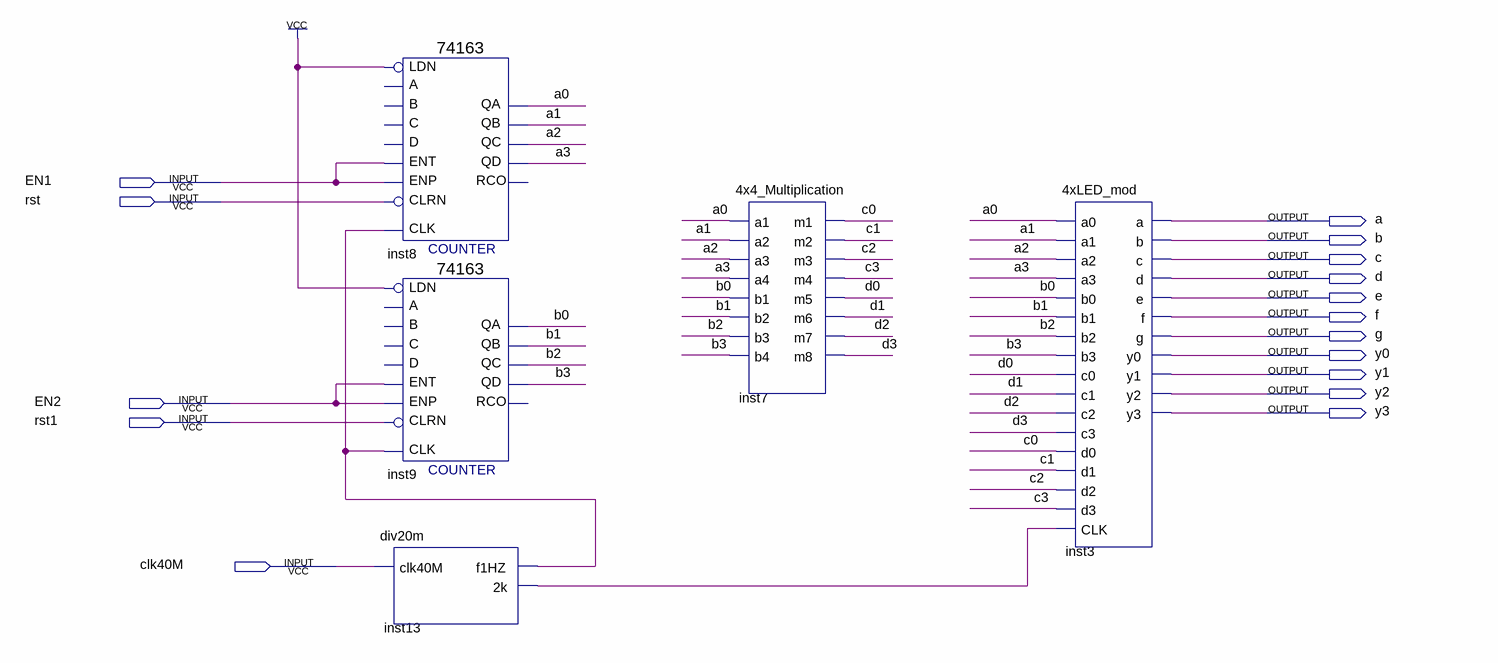
[diagram p0: schematic sheet]
// Quartus schematic 4xLED.bdf as structural Verilog: 5 symbols, 16 pins
module \4xLED  (
  input  EN1,
  input  rst,
  input  EN2,
  input  rst1,
  input  clk40M,
  output a,
  output b,
  output c,
  output d,
  output e,
  output f,
  output g,
  output y0,
  output y1,
  output y2,
  output y3
);

  wire a0, a1, a2, a3, b0, b1, b2, b3, c0, c1, c2, c3, d0, d1, d2, d3, inst13_2k, inst13_f1hz;

  \74163  inst8 (
    .ENT(EN1), .CLRN(rst), .CLK(inst13_f1hz), .ENP(EN1), .LDN(1'b1), .QA(a0), .QB(a1), .QC(a2), .QD(a3));  // open: C, B, A, D, RCO
  \74163  inst9 (
    .ENT(EN2), .CLRN(rst1), .CLK(inst13_f1hz), .ENP(EN2), .LDN(1'b1), .QA(b0), .QB(b1), .QC(b2), .QD(b3));  // open: C, B, A, D, RCO
  div20m inst13 (.clk40M(clk40M), .f1HZ(inst13_f1hz), .\2k (inst13_2k));
  \4x4_Multiplication  inst7 (
    .a1(a0), .a2(a1), .a3(a2), .a4(a3), .b1(b0), .b2(b1), .b3(b2), .b4(b3), .m1(c0), .m2(c1), .m3(c2),
    .m4(c3), .m5(d0), .m6(d1), .m7(d2), .m8(d3));
  \4xLED_mod  inst3 (
    .a0(a0), .a1(a1), .a2(a2), .a3(a3), .b0(b0), .b1(b1), .b2(b2), .b3(b3), .c0(d0), .c1(d1), .c2(d2),
    .c3(d3), .d0(c0), .d1(c1), .d2(c2), .d3(c3), .CLK(inst13_2k), .a(a), .b(b), .c(c), .d(d), .e(e), .f(f),
    .g(g), .y0(y0), .y1(y1), .y2(y2), .y3(y3));
endmodule
